# EAGLE design SMC_ISO_Interface_V2_0 (EAGLE 9.6.2)
SIZE: 0.04

## Sheet 1 of 2
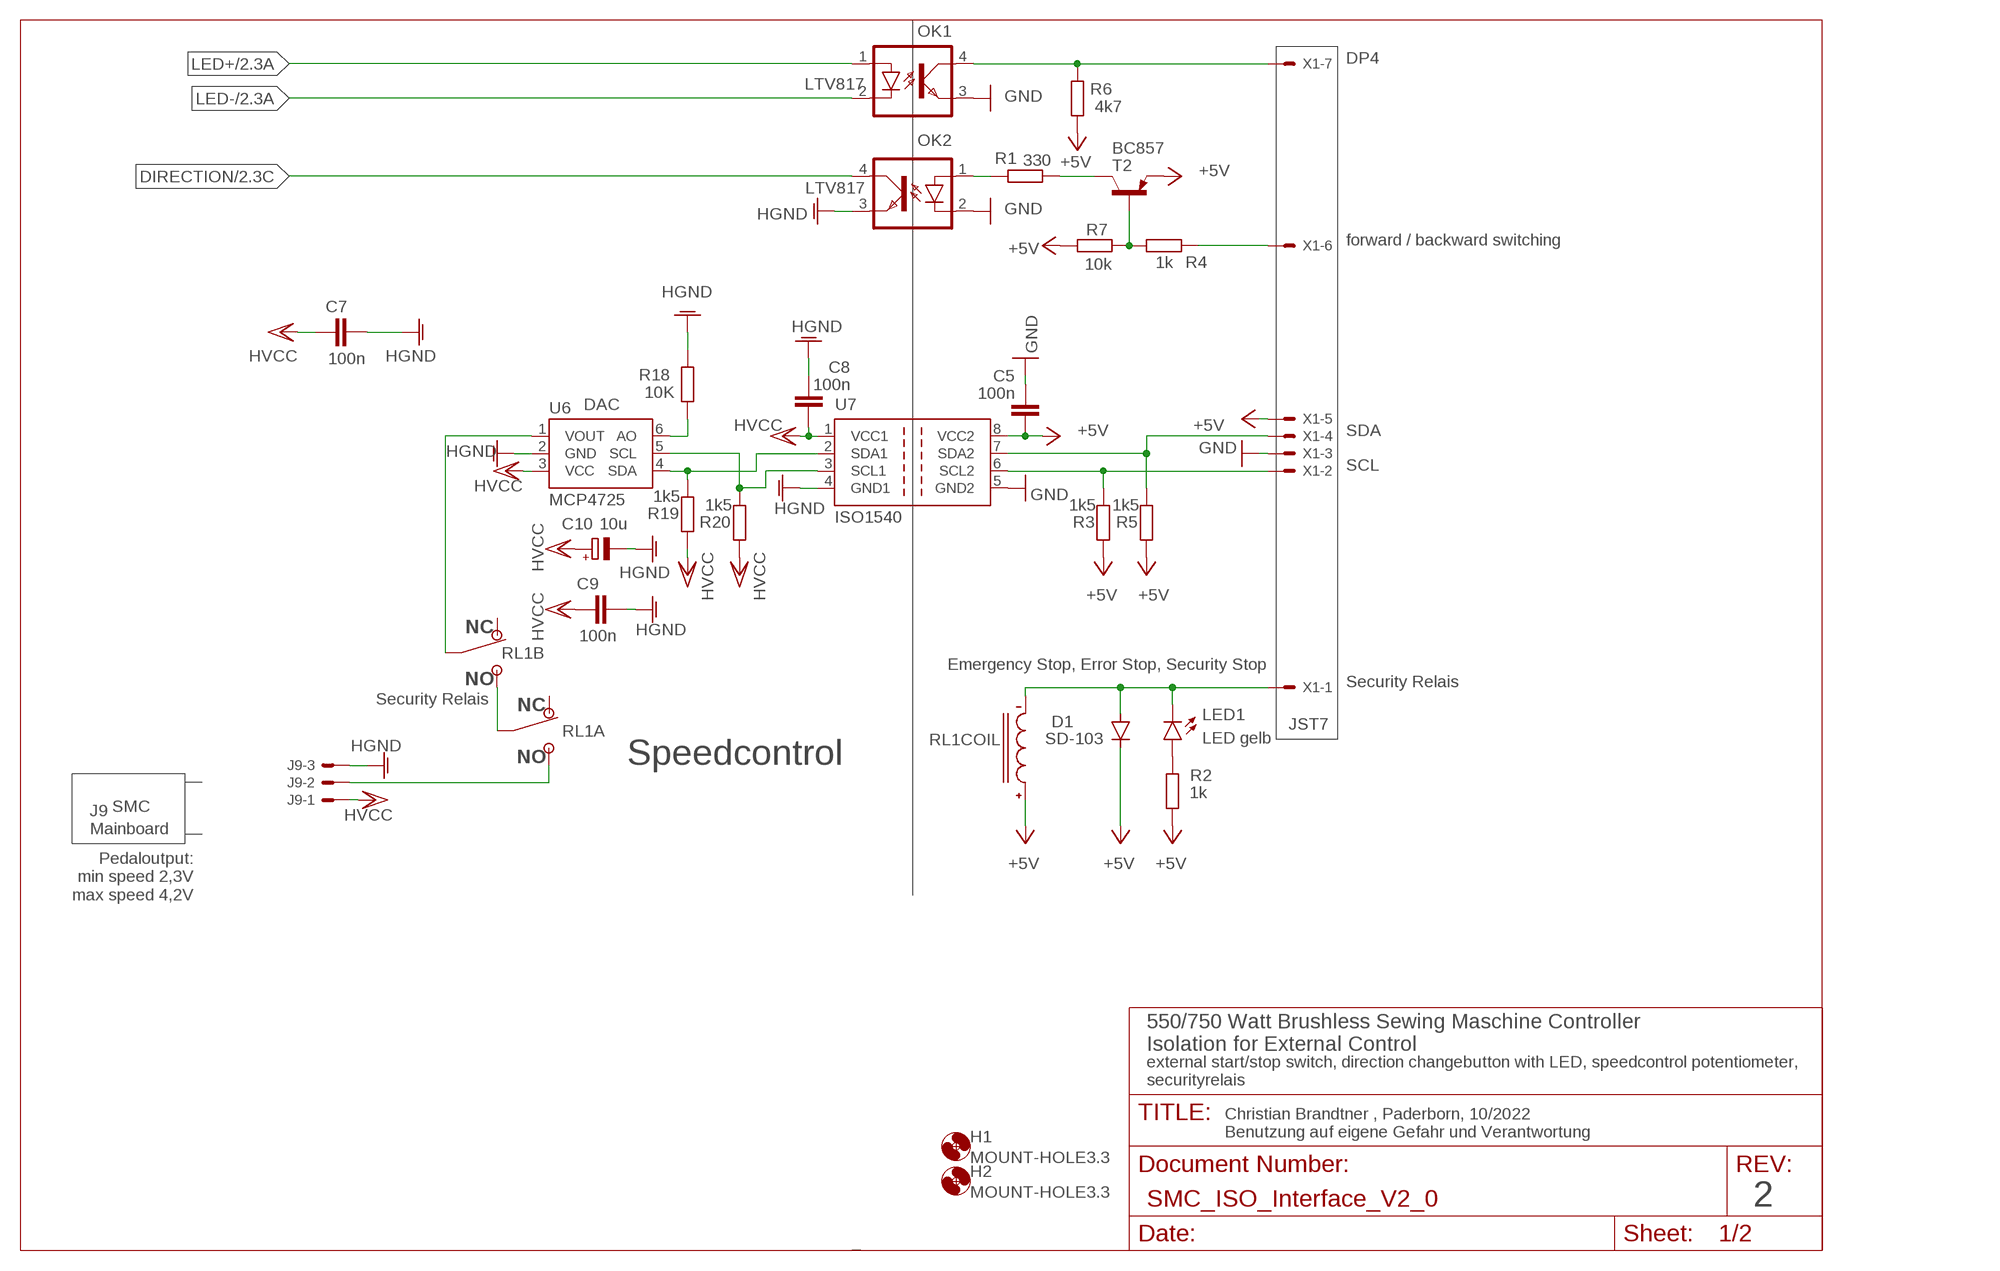
[diagram p0: schematic, sheet 1]

### Parts
C5  100n  C-EUC0805  [C0805]
C7  100n  C-EUC0805  [C0805]
C8  100n  C-EUC0805  [C0805]
C9  100n  C-EUC0805  [C0805]
C10  10u  CPOL-EU153CLV-0405  [153CLV-0405]
D1  SD-103  CGRM4001-G  [SOD-123_MINI-SMA]
H1  MOUNT-HOLE3.3  [3,3]
H2  MOUNT-HOLE3.3  [3,3]
J9  JST-XH-03-PIN-ROUND-PAD  [JST-XH-03-PACKAGE-ROUND-PAD]
LED1  LED gelb  LEDCHIP-LED0805  [CHIP-LED0805]
OK1  LTV817  SFH6186-2  [SMD4-7]
OK2  LTV817  SFH6186-2  [SMD4-7]
R1  330  R-EU_R0805  [R0805]
R2  1k  R-EU_R0805  [R0805]
R3  1k5  R-EU_R0805  [R0805]
R4  1k  R-EU_R0805  [R0805]
R5  1k5  R-EU_R0805  [R0805]
R6  4k7  R-EU_R0805  [R0805]
R7  10k  R-EU_R0805  [R0805]
R18  10K  R-EU_R0805  [R0805]
R19  1k5  R-EU_R0805  [R0805]
R20  1k5  R-EU_R0805  [R0805]
RL1  G6K-2F-DC5  [F]
T2  BC857  BC857ASMD  [SOT23-BEC]
U6  MCP4725  MCP4725SOT-23  [SOT23-6]
U7  ISO1540  [SO-08]
X1  JST7  JST-XH-07-PIN-ROUND-PAD  [JST-XH-07-PACKAGE-ROUND-PAD]

### Nets
+5V: C5.1 D1.C R2.1 R3.2 R5.2 R6.2 R7.1 RL1.P$1(COIL:C1) T2.E U7.8(VCC2) X1.5
DIRECTION: OK2.4(COL) ; also sheet 2
GND: C5.2 OK1.3(EMIT) OK2.2(C) U7.5(GND2) X1.3
HGND: C7.1 C8.2 C9.1 C10.- J9.3 OK2.3(EMIT) R18.1 U6.2(GND) U7.4(GND1) ; also sheet 2
HVCC: C7.2 C8.1 C9.2 C10.+ J9.1 R19.2 R20.2 U6.3(VCC) U7.1(VCC1) ; also sheet 2
LED+: OK1.1(A) ; also sheet 2
LED-: OK1.2(C) ; also sheet 2
N$2: OK2.1(A) R1.2
N$4: RL1.P$6(B:C) U6.1(VOUT)
N$5: R1.1 T2.C
N$6: LED1.A R2.2
N$7: RL1.P$3(A:C) RL1.P$5(B:NO)
N$8: J9.2 RL1.P$4(A:NO)
N$11: D1.A LED1.C RL1.P$8(COIL:C2) X1.1
N$14: R18.2 U6.6(AO)
N$26: R4.1 R7.2 T2.B
SCL: R3.1 U7.6(SCL2) X1.2
SCL_HV: R20.1 U6.5(SCL) U7.3(SCL1)
SDA: R5.1 U7.7(SDA2) X1.4
SDA_HV: R19.1 U6.4(SDA) U7.2(SDA1)
SMC_LED: OK1.4(COL) R6.1 X1.7
SMC_SW: R4.2 X1.6
Unconnected: RL1.P$2(A:NC) RL1.P$7(B:NC)

### Notes on the sheet
- DP4
- forward / backward switching
- DAC
- SDA
- SCL
- Emergency Stop, Error Stop, Security Stop
- Security Relais
- Security Relais
- Speedcontrol
- SMC
- J9
  Mainboard
- Pedaloutput:
  min speed 2,3V
  max speed 4,2V
- 550/750 Watt Brushless Sewing Maschine Controller
  Isolation for External Control
- external start/stop switch, direction changebutton with LED, speedcontrol potentiometer,
  securityrelais
- Christian Brandtner , Paderborn, 10/2022
  Benutzung auf eigene Gefahr und Verantwortung
- 2

## Sheet 2 of 2
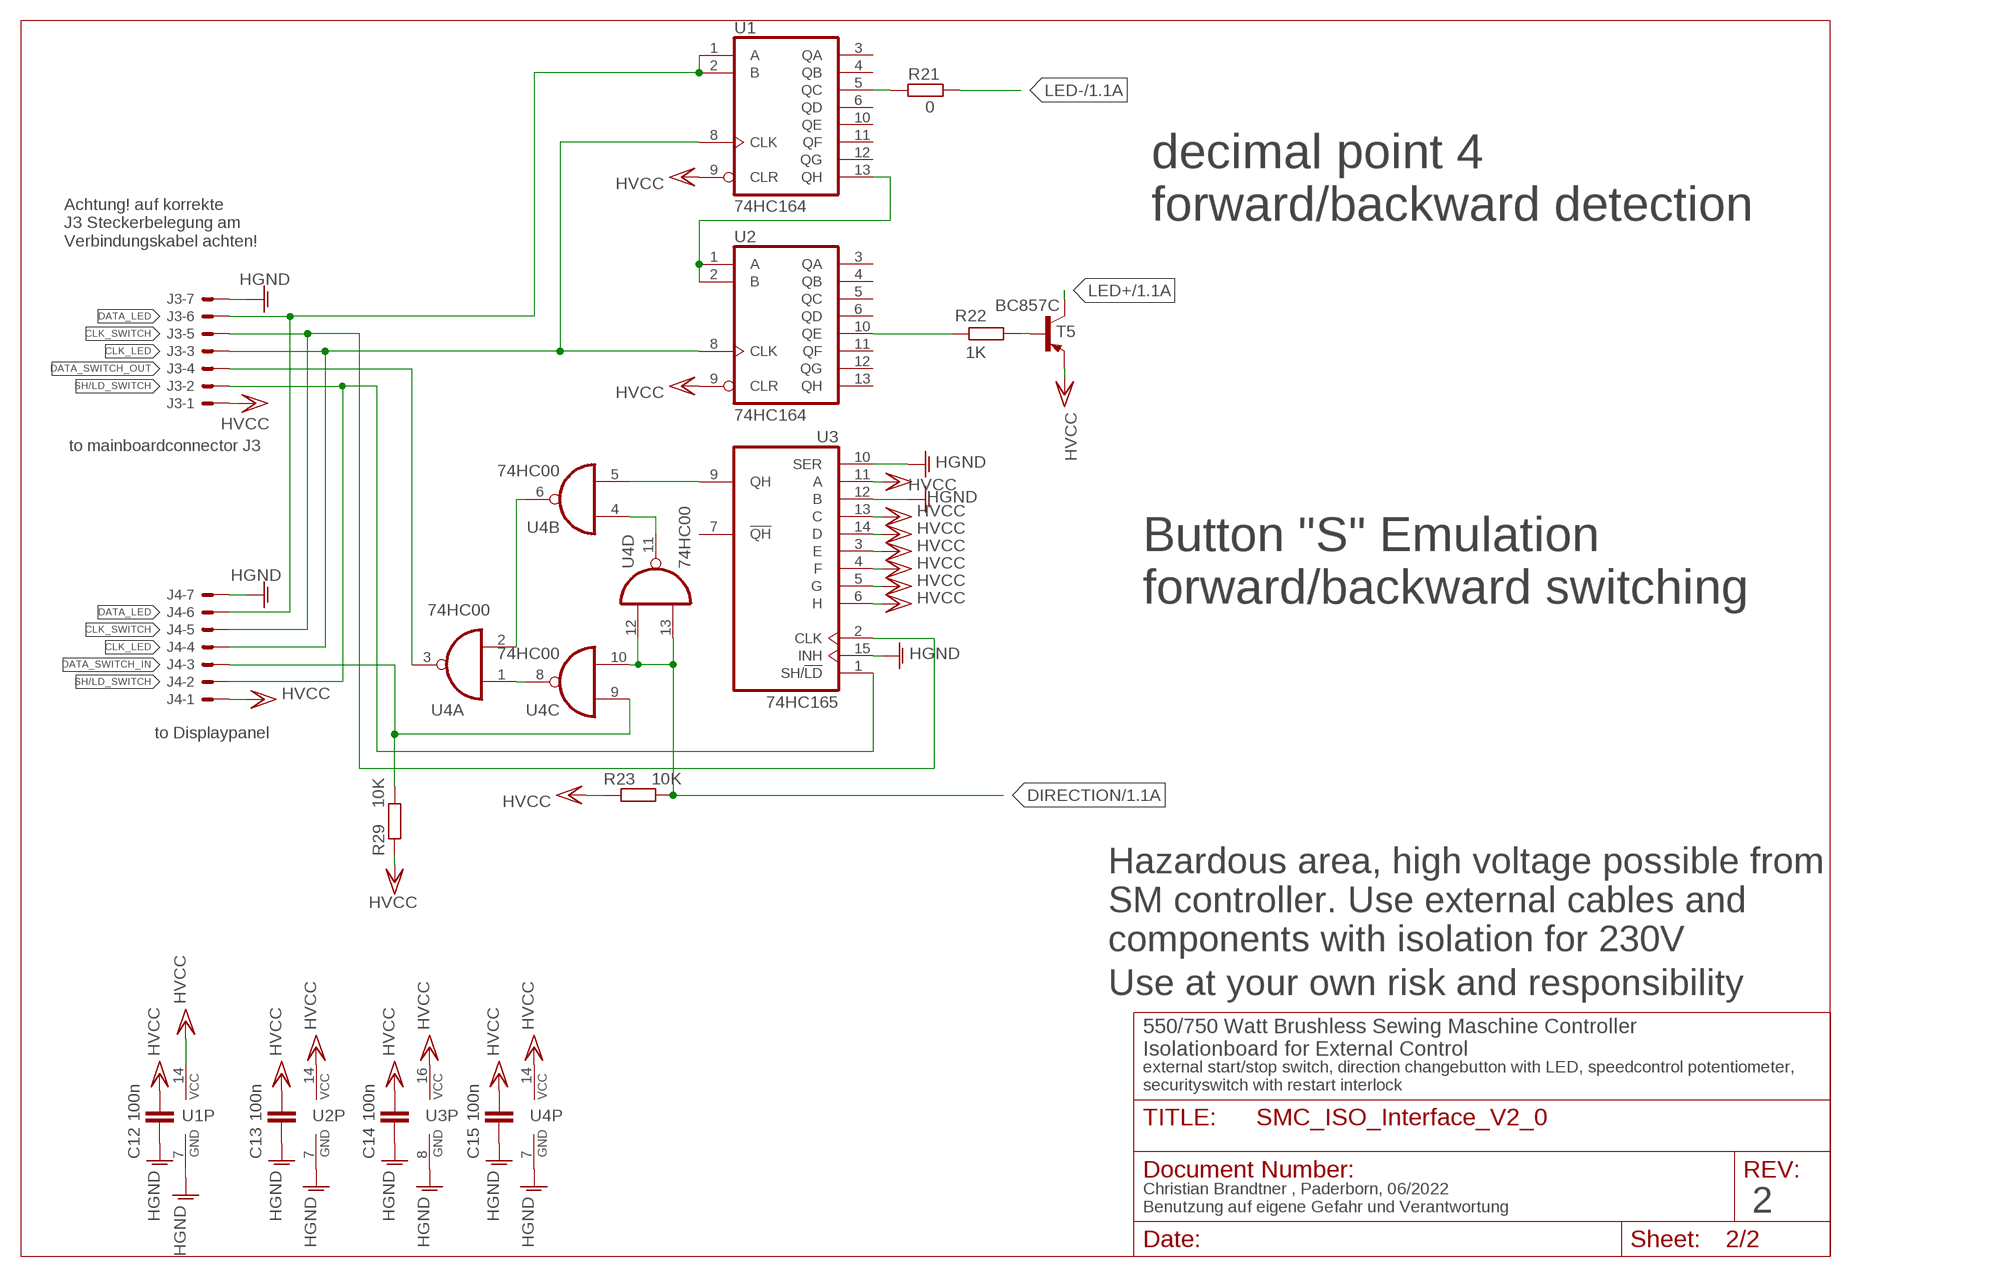
[diagram p1: schematic, sheet 2]

### Parts
C12  100n  C-EUC0805  [C0805]
C13  100n  C-EUC0805  [C0805]
C14  100n  C-EUC0805  [C0805]
C15  100n  C-EUC0805  [C0805]
J3  to mainboardconnector J3  JST-XH-07-PIN-ROUND-PAD  [JST-XH-07-PACKAGE-ROUND-PAD]
J4  to Displaypanel  JST-XH-07-PIN-ROUND-PAD  [JST-XH-07-PACKAGE-ROUND-PAD]
R21  0  R-EU_R0805  [R0805]
R22  1K  R-EU_R0805  [R0805]
R23  10K  R-EU_R0805  [R0805]
R29  10K  R-EU_R0805  [R0805]
T5  BC857C  BC857C-PNP-SOT23-BEC  [SOT23-BEC]
U1  74HC164  74HC164D  [SO14]
U2  74HC164  74HC164D  [SO14]
U3  74HC165  74HC165D  [SO16]
U4  74HC00  74HC00D  [SO14]

### Nets
CLK_LED: J3.3 J4.4 U1.8(CLK) U2.8(CLK)
CLK_SWITCH: J3.5 J4.5 U3.2(CLK)
DATA_LED: J3.6 J4.6 U1.1(A) U1.2(B)
DATA_SWITCH_IN: J4.3 R29.1 U4.9(C:I0)
DATA_SWITCH_OUT: J3.4 U4.3(A:O)
DIRECTION: R23.1 U4.10(C:I1) U4.12(D:I0) U4.13(D:I1) ; also sheet 1
G: U1.13(QH) U2.1(A) U2.2(B)
HGND: C12.1 C13.1 C14.1 C15.1 J3.7 J4.7 U1.7(GND) U2.7(GND) U3.8(GND) U3.10(SER) U3.12(B) U3.15(INH) U4.7(P:GND) ; also sheet 1
HVCC: C12.2 C13.2 C14.2 C15.2 J3.1 J4.1 R23.2 R29.2 T5.E U1.9(CLR) U1.14(VCC) U2.9(CLR) U2.14(VCC) U3.3(E) U3.4(F) U3.5(G) U3.6(H) U3.11(A) U3.13(C) U3.14(D) U3.16(VCC) U4.14(P:VCC) ; also sheet 1
LED+: T5.C ; also sheet 1
LED-: R21.2 ; also sheet 1
N$1: R22.1 T5.B
N$3: R21.1 U1.5(QC)
N$9: U3.9(QH) U4.5(B:I1)
N$10: U4.2(A:I1) U4.6(B:O)
N$12: U4.1(A:I0) U4.8(C:O)
N$13: U4.4(B:I0) U4.11(D:O)
N$27: R22.2 U2.10(QE)
SH/LD_SWITCH: J3.2 J4.2 U3.1(SH/!LD)
Unconnected: U1.3(QA) U1.4(QB) U1.6(QD) U1.10(QE) U1.11(QF) U1.12(QG) U2.3(QA) U2.4(QB) U2.5(QC) U2.6(QD) U2.11(QF) U2.12(QG) U2.13(QH) U3.7(!QH)

### Notes on the sheet
- decimal point 4 
  forward/backward detection
- Achtung! auf korrekte
  J3 Steckerbelegung am 
  Verbindungskabel achten!
- Button "S" Emulation
  forward/backward switching
- Hazardous area, high voltage possible from
  SM controller. Use external cables and
  components with isolation for 230V
- Use at your own risk and responsibility
- 550/750 Watt Brushless Sewing Maschine Controller 
  Isolationboard for External Control
- external start/stop switch, direction changebutton with LED, speedcontrol potentiometer,
  securityswitch with restart interlock
- Christian Brandtner , Paderborn, 06/2022
  Benutzung auf eigene Gefahr und Verantwortung
- 2

## Library data of the parts
C5 C7-C9 C12-C15 = rcl:C-EU: CAPACITOR, European symbol; SPICEPREFIX: C
C10 = rcl:CPOL-EU: POLARIZED CAPACITOR, European symbol; SPICEPREFIX: C
D1 = diode:CGRM400*-G: Molded plasitc,JEDEC SOD-123/Mini SMA Source: Comchip CGRM4001-G.pdf
H1 H2 = holes:MOUNT-HOLE: MOUNTING HOLE with drill center marker
J3 J4 X1 = Rembrandt Electronics - JST XH Connectors v1-0:JST-XH-07-PIN: JST XH Connector 2 Pin Wire to board connector. Pitch: 2,54 mm, (0.100") Number of pins: 7 Created by Rembrandt Electronics www.rembrandtelectronics.com
J9 = Rembrandt Electronics - JST XH Connectors v1-0:JST-XH-03-PIN: JST XH Connector 2 Pin Wire to board connector. Pitch: 2,54 mm, (0.100") Number of pins: 3 Created by Rembrandt Electronics www.rembrandtelectronics.com
LED1 = led:LED: LED OSRAM: - CHIPLED LG R971, LG N971, LY N971, LG Q971, LY Q971, LO R971, LY R971 LH N974, LH R974 LS Q976, LO Q976, LY Q976 LO Q996 - Hyper CHIPLED LW Q18S LB Q993, LB Q99A, LB R99A - SideLED LS A670, LO A670, LY A670, LG A670, LP A670 LB A673, LV A673, LT A673, LW A673 LH A674 LY A675 LS A676, LA A676, LO A676, LY A676, LW A676 LS A679, LY A679, LG A679 - Hyper Micro SIDELED® LS Y876, LA Y876, LO Y876, LY Y876 LT Y87S - SmartLED LW L88C, LW L88S LB L89C, LB L89S, LG L890 LS L89K, LO L89K, LY L89K LS L896, LA L896, LO L896, LY L896 - TOPLED LS T670, LO T670, LY T670, LG T670, LP T670 LSG T670, LSP T670, LSY T670, LOP T670, LYG T670 LG T671, LOG T671, LSG T671 LB T673, LV T673, LT T673, LW T673 LH T674 LS T676, LA T676, LO T676, LY T676, LB T676, LH T676, LSB T676, LW T676 LB T67C, LV T67C, LT T67C, LS T67K, LO T67K, LY T67K, LW E67C LS E67B, LA E67B, LO E67B, LY E67B, LB E67C, LV E67C, LT E67C LW T67C LS T679, LY T679, LG T679 LS T770, LO T770, LY T770, LG T770, LP T770 LB T773, LV T773, LT T773, LW T773 LH T774 LS E675, LA E675, LY E675, LS T675 LS T776, LA T776, LO T776, LY T776, LB T776 LHGB T686 LT T68C, LB T68C - Hyper Mini TOPLED® LB M676 - Mini TOPLED Santana® LG M470 LS M47K, LO M47K, LY M47K Source: http://www.osram.convergy.de LUXEON: - LUMILED® LXK2-PW12-R00, LXK2-PW12-S00, LXK2-PW14-U00, LXK2-PW14-V00 LXK2-PM12-R00, LXK2-PM12-S00, LXK2-PM14-U00 LXK2-PE12-Q00, LXK2-PE12-R00, LXK2-PE12-S00, LXK2-PE14-T00, LXK2-PE14-U00 LXK2-PB12-K00, LXK2-PB12-L00, LXK2-PB12-M00, LXK2-PB14-N00, LXK2-PB14-P00, LXK2-PB14-Q00 LXK2-PR12-L00, LXK2-PR12-M00, LXK2-PR14-Q00, LXK2-PR14-R00 LXK2-PD12-Q00, LXK2-PD12-R00, LXK2-PD12-S00 LXK2-PH12-R00, LXK2-PH12-S00 LXK2-PL12-P00, LXK2-PL12-Q00, LXK2-PL12-R00 Source: www.luxeon.com KINGBRIGHT: KA-3528ASYC Source: www.kingbright.com
OK1 OK2 = optocoupler:SFH618?*: Optocoupler, Phototransistor Output, Low Input Current Source: Data sheet <http://www.vishay.com/docs/83673/sfh618.pdf>; MF: VISHAY/TELEFUNKEN; MPN: SFH6186-2; OC_FARNELL: 1469583; OC_NEWARK: 58K2210
R1-R7 R18-R23 R29 = resistor:R-EU_: RESISTOR, European symbol
RL1 = Omron-G6K-Relay:G6K-2?*: OMRON Subminiature low power relay - DPDT Note: see G6KU variant for latching relays Packages: F SMD wings (to the side) G SMD J leads (under) P Through-hole Features no suffix: 1500v coil-switch insulation -Y suffix: 2500v coil-switch insulation
T2 = transistor-pnp:BC857*: PNP Transistror
T5 = transistor:*-PNP-: PNP Transistror
U1 U2 = 74xx-eu:74*164: 8-bit parallel out SHIFT REGISTER
U3 = 74xx-eu:74*165: 8-bit parallel load SHIFT REGISTER
U4 = 74xx-eu@1:74*00: Quad 2-input NAND gate
U6 = SparkFun-IC-Conversion:MCP4725: MCP4725 DAC Microchip 12-bit I2C DAC, SOT23-6 Datasheet <https://cdn.sparkfun.com/datasheets/BreakoutBoards/MCP4725_2009.pdf> SparkFun Products SparkFun I2C DAC Breakout - MCP4725 <https://www.sparkfun.com/products/12918> (BOB-12918); PROD_ID: IC-08886
U7 = texas_CB:ISO1540

## Board
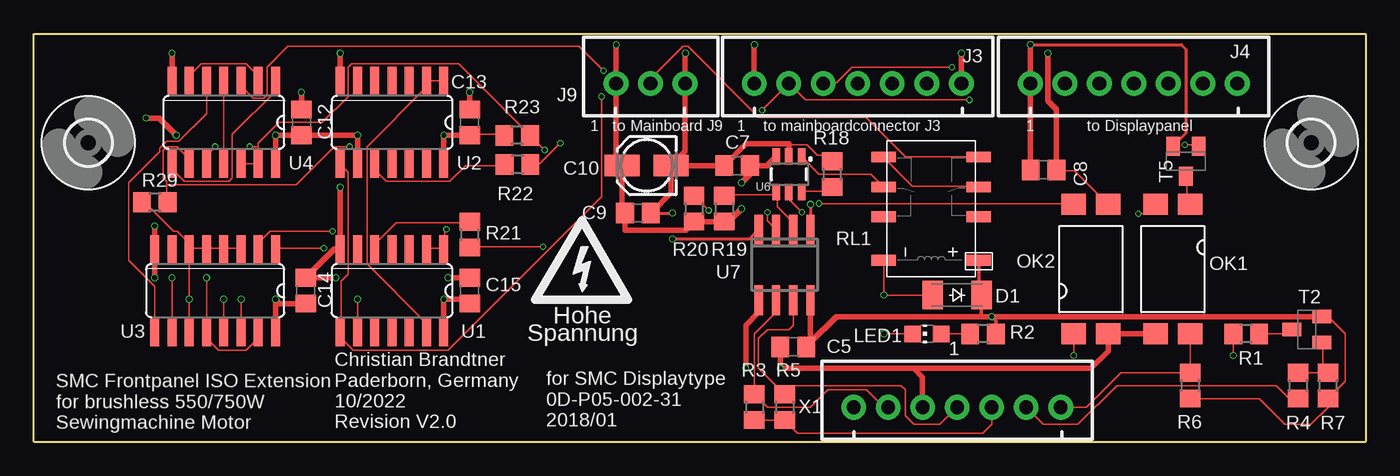
[diagram p2: board, top side]
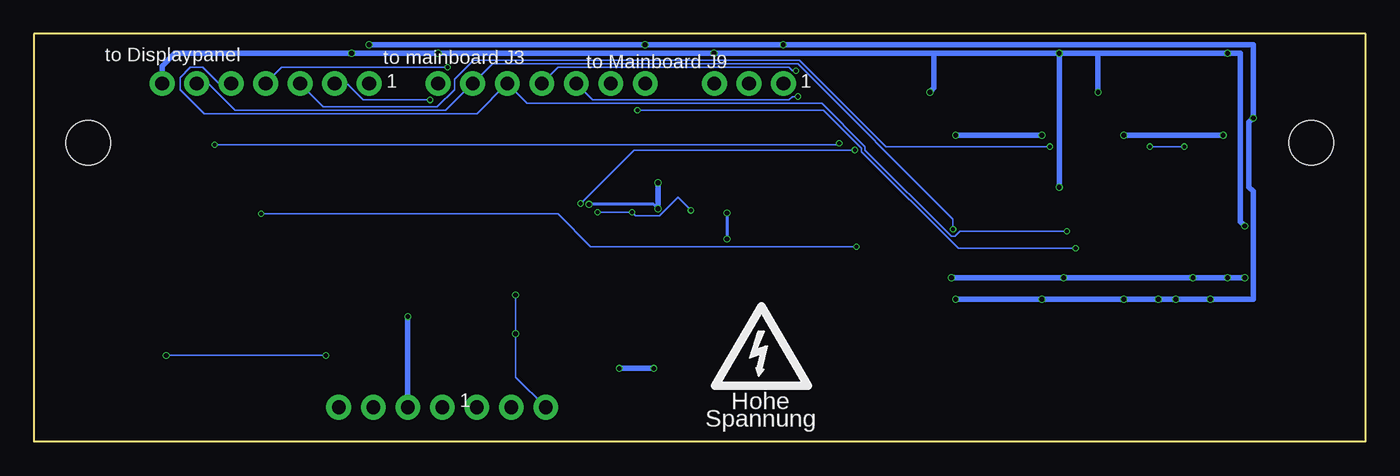
[diagram p3: board, bottom side, seen from below]

Size 98 x 30 mm. Coordinates in mm from the lower left corner, seen from the top.
Outline: 0,0 0,30 98,30 98,0 0,0
Copper layers (1*16): Top 0.035mm / dielectric 1.6mm / Bottom 0.035mm
Design rules "jlcpcb-2layers": minimum track width 5mil, minimum drill 0.3mm, track to track 5mil, track to pad 5mil, pad to pad 5mil, via to via 5mil, smd to smd 5mil, copper to edge 0.2mm, drill to drill 6mil, minimum pad ring 10mil, minimum via ring 3mil, stop-mask expansion 4mil, vias tented up to drill 0mil, thermal gap 10mil
tRestrict: area 52.1,0 to 97.8,14.3; area 74.9,14.3 to 87.3,16.5; area 59.1,14.3 to 74.9,16.2
bRestrict: area 52.1,0.3 to 97.8,14.3; area 74.9,14.3 to 87.3,16.5; area 61.6,14.3 to 75.2,16.2; area 59.1,14.3 to 61.6,16.2

### Footprints (pad centres in the part's own frame; a part is rotated, then mirrored left to right if it is on the bottom)
C0805 = smd 1.3 x 1.5: 1 -0.95,0; 2 0.95,0
153CLV-0405 = smd 2.6 x 1.6: + 1.8,0; - -1.8,0
SOD-123_MINI-SMA = smd 1.5 x 2.1: A 1.8,0; C -1.8,0
3,3 = hole 3.3: 0,0
JST-XH-07-PACKAGE-ROUND-PAD = drill 1.016: 1 -7.62,0; 2 -5.08,0; 3 -2.54,0; 4 0,0; 5 2.54,0; 6 5.08,0; 7 7.62,0
JST-XH-03-PACKAGE-ROUND-PAD = drill 1.016: 1 -2.54,0; 2 0,0; 3 2.54,0
CHIP-LED0805 = smd 1.2 x 1.2: A 0,-1.05; C 0,1.05
SMD4-7 = smd 1.78 x 1.55: 1 -1.27,-4.77; 2 1.27,-4.77; 3 1.27,4.77; 4 -1.27,4.77
R0805 = smd 1.3 x 1.5: 1 -0.95,0; 2 0.95,0
F = smd 0.8 x 1.8: P$1 -3.8,-3.5; P$2 -0.6,-3.5; P$3 1.6,-3.5; P$4 3.8,-3.5; P$5 3.8,3.5; P$6 1.6,3.5; P$7 -0.6,3.5; P$8 -3.8,3.5
SOT23-BEC = smd 1 x 1.4: B -0.95,-1.1; C 0,1.1; E 0.95,-1.1
SO14 = smd 0.66 x 2.032: 1 -3.81,-3.073; 2 -2.54,-3.073; 3 -1.27,-3.073; 4 0,-3.073; 5 1.27,-3.073; 6 2.54,-3.073; 7 3.81,-3.073; 8 3.81,3.073; 9 2.54,3.073; 10 1.27,3.073; 11 0,3.073; 12 -1.27,3.073; 13 -2.54,3.073; 14 -3.81,3.073
SO16 = smd 0.66 x 2.032: 1 -4.445,-3.073; 2 -3.175,-3.073; 3 -1.905,-3.073; 4 -0.635,-3.073; 5 0.635,-3.073; 6 1.905,-3.073; 7 3.175,-3.073; 8 4.445,-3.073; 9 4.445,3.073; 10 3.175,3.073; 11 1.905,3.073; 12 0.635,3.073; 13 -0.635,3.073; 14 -1.905,3.073; 15 -3.175,3.073; 16 -4.445,3.073
SOT23-6 = smd 0.55 x 1.2: 1 0.95,1.3; 2 0,1.3; 3 -0.95,1.3; 4 -0.95,-1.3; 5 0,-1.3; 6 0.95,-1.3
SO-08 = smd 0.6 x 2.2: 1 -1.905,-2.6; 2 -0.635,-2.6; 3 0.635,-2.6; 4 1.905,-2.6; 5 1.905,2.6; 6 0.635,2.6; 7 -0.635,2.6; 8 -1.905,2.6

### Placement (x,y rotation side)
C5  55.88,6.99 180 top
C7  51.75,20.32 0 top
C8  74.3,20 0 top
C9  44.45,16.83 180 top
C10  45.09,20.32 180 top
C12  19.68,23.5 270 top
C13  32.07,23.5 270 top
C14  20,11.11 270 top
C15  32.07,11.11 270 top
D1  67.94,10.79 180 top
H1  4,22 0 top
H2  94,22 0 top
J3  60.63,26.35 0 top
J4  80.95,26.35 0 top
J9  45.39,26.35 0 top
LED1  65.72,7.94 90 top
OK1  83.82,12.7 180 top
OK2  77.79,12.7 0 top
R1  89.22,7.94 180 top
R2  69.85,7.94 180 top
R3  53.02,2.54 270 top
R4  93.03,4.13 270 top
R5  55.24,2.54 270 top
R6  85.09,4.13 270 top
R7  95.25,4.13 90 top
R18  58.74,19.68 270 top
R19  50.8,17.14 270 top
R20  48.58,17.14 270 top
R21  32.07,15.24 270 top
R22  35.59,20.4 180 top
R23  35.56,22.54 180 top
R29  8.89,17.62 180 top
RL1  66.04,17.14 90 top
T2  93.66,8.26 90 top
T5  84.77,20.64 180 top
U1  26.35,11.11 180 top
U2  26.35,23.5 180 top
U3  13.34,11.11 180 top
U4  13.97,23.5 180 top
U6  55.56,19.68 0 top
U7  55.24,13.02 180 top
U$53  [HIGHVOLT1_TOP]  40.32,13.34 0 top
U$55  [HIGHVOLT1_BOT]  44.48,4.63 0 top
X1  67.94,2.54 0 top

### Tracks (layer width: path | path; a pad name or v marks a point on that pad's centre or on a via)
+5V  (via drill 0.35)
  Top 0.127: X1.5 70.48,1.27 69.85,0.64 56.2,0.64 R5.2 R3.2 | T2.E 95.25,9.21 96.52,7.94 96.52,4.45 R7.1 95.25,2.54 93.98,1.27 92.08,1.27 90.17,3.18 R6.2
  Top 0.254: RL1.P$1 69.54,11 D1.C 69.75,9.42 69.53,9.21 | R2.1 70.8,8.89 v70.48,9.21
  Top 0.406: 57.15,7.3 C5.1 | 57.15,7.3 U7.8 | 57.15,7.3 59.05,9.21 69.53,9.21 v70.48,9.21 T2.E
  Bottom 0.406: X1.5 v70.48,9.21
CLK_LED  (via drill 0.3)
  Top 0.127: U2.8 22.61,20.32 23.11,19.81 23.11,12.32 22.61,11.81 22.61,8.13 U1.8 22.61,8 22.61,7.62 23.5,6.73 30.48,6.73 41.78,18.03 v41.78,25.4 | v67.56,27.56 60.2,27.56 59.05,26.42 58.17,26.42 J3.3
  Bottom 0.127: v67.56,27.56 79.76,27.56 80.9,26.42 J4.4 | v41.78,25.4 42.16,25.4 42.42,25.15 56.9,25.15 58.04,26.29 J3.3
CLK_SWITCH  (via drill 0.3)
  Top 0.127: U3.2 16.51,14.61 17.4,15.49 v21.97,15.49
  Bottom 0.127: v21.97,15.49 29.84,15.49 30.23,15.11 30.48,15.11 36.83,21.46 36.83,21.72 40.01,24.89 61.72,24.89 63.12,26.29 J3.5 63.25,26.29 65.41,24.13 85.47,24.13 87.25,25.91 87.25,26.8 86.49,27.56 85.6,27.56 84.45,26.42 83.57,26.42 J4.5
DATA_LED  (via drill 0.3)
  Top 0.127: U1.2 28.96,14.22 30.1,14.22 U1.1 30.23,14.22 30.23,15.49 v30.35,15.62
  Bottom 0.127: v30.35,15.62 30.35,16.38 41.78,27.81 64.26,27.81 65.66,26.42 J3.6 65.79,26.29 67.69,24.38 83.19,24.38 85.09,26.29 85.98,26.29 J4.6
DATA_SWITCH_IN  (via drill 0.3)
  Top 0.127: 9.78,18.92 9.78,19.18 9.53,19.43 9.53,21.46 9.78,21.72 10.54,21.72 11.43,20.83 U4.9 | 9.78,18.92 9.78,17.65 R29.1 | 9.78,18.92 19.3,18.92 22.1,21.72 v23.24,21.72
  Bottom 0.127: v23.24,21.72 35.31,21.72 41.66,28.07 65.66,28.07 67.06,26.67 67.06,25.91 68.33,24.64 76.71,24.64 78.36,26.29 J4.3
DATA_SWITCH_OUT  (via drill 0.3)
  Top 0.127: U4.3 15.24,26.16 16.13,25.27 16.89,25.27 17.14,25.53 17.14,27.56 18.67,29.08 40.13,29.08 v41.91,27.3
  Bottom 0.127: v41.91,27.3 42.16,27.3 42.42,27.56 59.44,27.56 60.58,26.42 J3.4
DIRECTION  (via drill 0.3)
  Top 0.127: 16.51,20.45 16.51,21.72 | 16.51,21.72 16.51,21.97 18.03,23.5 21.21,23.5 23.11,25.4 23.11,27.56 23.37,27.81 31.24,27.81 36.45,22.61 R23.1 36.58,22.48 v37.59,21.46 | v57.78,17.53 76.45,17.53 OK2.4 | U4.10 12.7,21.08 v13.34,21.72 | 16.51,21.72 v15.88,21.72 | 16.51,20.45 15.24,20.45 U4.12 | 16.51,20.45 U4.13
  Bottom 0.127: v57.78,17.53 53.85,21.46 v37.59,21.46 | v15.88,21.72 v13.34,21.72
G
  Top 0.127: U1.13 28.83,8.13 28.83,8.76 24.51,13.08 24.51,21.72 28.83,26.04 28.83,26.54 U2.2 28.96,26.54 30.1,26.54 U2.1
GND  (via drill 0.35)
  Top 0.406: OK1.3 OK2.2 79.06,6.67 77.79,5.4 64.77,5.4 | X1.3 65.41,4.76 64.77,5.4 | 64.77,5.4 v54.93,5.4 C5.2 | U7.5 53.34,9.53 52.39,8.57 v52.39,5.4
  Bottom 0.406: v52.39,5.4 v54.93,5.4
HGND  (via drill 0.35)
  Top 0.127: U3.10 v10.16,12.06 | v12.7,12.06 U3.12 12.7,7.62 13.59,6.73 15.62,6.73 16.51,7.62 U3.15 | R18.1 58.29,21.08 57.66,21.08 56.9,21.84 55.75,21.84 55.56,21.91 | C8.2 75.44,19.94 76.58,19.94 78.99,17.53 OK2.3
  Top 0.203: C9.1 v46.99,16.83 | v46.99,14.92 52.65,14.92 U7.4
  Top 0.406: v10.16,28.57 U4.7 | U2.7 v22.54,28.57 | C12.1 v19.68,25.72 | C13.1 v32.07,25.72 | v8.89,15.88 U3.8 v8.89,12.06 | v22.54,18.73 U1.7 22.13,14.19 C14.1 v22.23,12.06 | C15.1 v30.48,12.06 | v47.94,28.57 47.93,28.56 J9.3 47.93,21.36 C10.- | J3.7 68.25,28.56 v68.26,28.57 | C8.2 75.25,24.45 74.61,25.08 v74.61,28.57 | C10.- 46.88,18.31 C9.1 | C10.- C7.1 52.4,21.91 55.02,21.91 55.03,21.91 55.56,21.91 U6.2
  Bottom 0.203: v46.99,16.83 v46.99,14.92
  Bottom 0.406: 31.75,28.57 v22.54,28.57 | v22.54,28.57 19.68,28.57 | 19.68,28.57 v10.16,28.57 9.21,28.57 9.21,16.19 v8.89,15.88 | v19.68,25.72 19.68,28.57 | 31.75,28.57 31.75,26.04 v32.07,25.72 | v22.54,18.73 v22.54,28.57 | v30.48,12.06 v22.23,12.06 v12.7,12.06 v10.16,12.06 v8.89,12.06 | 31.75,28.57 v47.94,28.57 v68.26,28.57 v74.61,28.57 87.63,28.57 88.57,27.64 J4.7
HVCC  (via drill 0.35)
  Top 0.127: U3.14 v15.24,10.48 | U3.13 v13.97,10.48 | U3.11 v11.43,10.48 U3.6 11.43,14.22 | U1.9 v23.81,10.48 | 11.43,14.22 12.7,14.22 | 12.7,14.22 13.97,14.22 | 12.7,14.22 U3.5 | 13.97,14.22 15.24,14.22 U3.3 | 13.97,14.22 U3.4 | 11.43,14.22 11.43,14.61 10.54,15.49 10.29,15.49 8.26,17.53 8,17.53 R29.2 | R23.2 34.54,22.61 32.26,22.61 C13.2
  Top 0.203: v73.34,29.21 84.45,29.21 84.77,28.89 84.77,22.69 T5.E | v57.15,17.46 U7.1
  Top 0.406: U3.16 v17.78,10.48 18.09,10.16 C14.2 | v10.48,22.54 9.21,23.81 v8.26,23.81 | U4.14 v17.78,22.54 v17.78,22.55 C12.2 v23.81,22.55 v23.81,22.54 U2.9 | U2.14 v30.16,22.54 v30.16,22.55 C13.2 | U1.14 v30.16,10.48 31.75,10.48 C15.2 | v73.34,29.21 73.34,26.37 J4.1 73.34,26.34 C8.1 | v42.86,29.21 42.85,29.2 J9.1 42.85,20.76 C10.+ 43.28,17.04 C9.2 43.5,15.56 47.94,15.56 R20.2 R19.2 51.12,16.2 v52.07,17.14 | J3.1 53.01,29.2 v53.02,29.21 | v52.07,19.05 52.7,19.68 C7.2 53.95,20.32 U6.3
  Bottom 0.203: v52.07,17.14 52.39,17.46 v57.15,17.46
  Bottom 0.406: v17.78,22.54 v10.48,22.54 | v23.81,22.54 v30.16,22.54 | v30.16,10.48 v23.81,10.48 v17.78,10.48 v15.24,10.48 v13.97,10.48 v11.43,10.48 8.26,10.48 8.26,18.41 8.57,18.73 8.57,23.5 v8.26,23.81 8.26,29.21 v42.86,29.21 v53.02,29.21 v73.34,29.21 | v52.07,17.14 v52.07,19.05
LED+
  Top 0.127: T5.C 84.84,19.43 84.84,17.78 85.09,17.53 OK1.1
LED-  (via drill 0.3)
  Top 0.127: v37.47,14.35 32.13,14.35 R21.2 | v81.28,16.76 81.92,16.76 82.55,17.4 OK1.2
  Bottom 0.127: v37.47,14.35 57.02,14.35 59.44,16.76 v81.28,16.76
N$1  (via drill 0.3)
  Top 0.127: v84.71,21.84 85.6,21.84 T5.B | v38.73,21.97 37.21,20.45 36.58,20.45 R22.1
  Bottom 0.127: v84.71,21.84 38.86,21.84 v38.73,21.97
N$2  (via drill 0.35)
  Top 0.127: R1.2 v88.27,6.35 | v76.52,6.35 OK2.1
  Bottom 0.127: v88.27,6.35 v76.52,6.35
N$3
  Top 0.127: R21.1 32,16.13 26.67,16.13 25.15,14.61 25.15,14.22 U1.5
N$4
  Top 0.127: U6.1 56.52,20.95 57.78,19.68 61.59,19.68 62.48,18.8 RL1.P$6
N$5
  Top 0.127: T2.C 92.25,7.94 R1.1
N$6
  Top 0.127: R2.2 LED1.A
N$7
  Top 0.127: RL1.P$3 69.47,18.8 64.64,18.8 62.61,20.83 RL1.P$5
N$8
  Top 0.127: RL1.P$4 69.47,20.95 64.14,20.95 61.21,23.88 53.34,23.88 48.13,29.08 47.75,29.08 45.47,26.8 45.47,26.42 J9.2
N$9
  Top 0.127: U3.9 8.89,11.43 6.99,13.34 6.99,19.05 9.27,21.34 9.27,21.59 9.78,22.1 10.67,22.1 12.7,24.13 U4.5
N$10
  Top 0.127: U4.6 11.43,26.92 12.32,27.81 15.62,27.81 16.51,26.92 U4.2
N$11  (via drill 0.35)
  Top 0.127: RL1.P$8 v62.55,10.79 D1.A | LED1.C v62.55,7.94
  Bottom 0.127: v62.55,10.79 v62.55,7.94 62.55,4.76 X1.1
N$12
  Top 0.127: U4.8 10.16,20.07 11.05,19.18 14.35,19.18 14.61,19.43 14.61,22.61 17.78,25.78 U4.1
N$13
  Top 0.127: U4.4 U4.11
N$14
  Top 0.127: U6.6 56.52,18.41 58.42,18.41 58.67,18.67 R18.2
N$26
  Top 0.127: T2.B 94.85,7.22 94.85,5.48 R7.2 R4.1
N$27
  Top 0.127: R22.2 34.54,20.32 31.75,20.32 30.61,19.18 25.91,19.18 25.15,19.94 25.15,20.32 U2.10
SCL
  Top 0.127: U7.6 54.61,9.53 53.02,7.94 R3.1 53.97,2.54 57.15,2.54 58.42,3.81 61.28,3.81 62.55,2.54 X1.2
SCL_HV  (via drill 0.3)
  Top 0.127: v56.52,16.89 55.63,17.78 55.63,18.29 U6.5 | v53.98,16.89 53.98,16.26 U7.3 | v49.66,17.02 48.64,18.03 R20.1
  Bottom 0.127: v56.52,16.89 v53.98,16.89 53.72,16.64 51.94,16.64 50.61,17.97 v49.66,17.02
SDA
  Top 0.127: R5.1 | R5.1 53.34,5.39 53.34,7.62 53.98,8.26 55.56,8.26 55.88,8.57 U7.7 | R5.1 55.88,4.13 63.82,4.13 64.14,3.81 64.14,1.91 64.77,1.27 66.67,1.27 X1.4
SDA_HV
  Top 0.127: 54.74,18.16 54.74,17.27 55.88,16.13 U7.2 | 54.74,18.16 54.74,18.29 U6.4 54.74,18.16 | 54.74,18.16 50.8,18.16 R19.1
SH/LD_SWITCH  (via drill 0.3)
  Top 0.127: v21.34,14.22 17.78,14.22 U3.1 | v53.59,24.38 55.5,26.29 J3.2 55.63,26.29 56.77,25.15 v68.83,25.15
  Bottom 0.127: v21.34,14.22 29.97,14.22 37.08,21.34 37.08,21.59 39.88,24.38 v53.59,24.38 | v68.83,25.15 73.79,25.15 74.93,26.29 75.82,26.29 J4.2
SMC_LED
  Top 0.127: X1.7 77.47,2.54 80.01,5.08 R6.1 OK1.4
SMC_SW
  Top 0.127: X1.6 74.3,1.27 76.83,1.27 79.69,4.13 91.44,4.13 92.39,3.18 R4.2

### Text on the board
tPlace: 1 | to Mainboard J9 | 1 | 1 | 1 | SMC Frontpanel ISO Extension / for brushless 550/750W / Sewingmachine Motor | Christian Brandtner / Paderborn, Germany / 10/2022 / Revision V2.0 | for SMC Displaytype / 0D-P05-002-31 / 2018/01
bPlace: 1 | 1 | to mainboard J3 | to Displaypanel | to Mainboard J9 | 1 | 1 | 1
bDocu: 1 | 1 | 1
202bmp: /home/cebra/EAGLE/danger_sw.bmp